# Altium schematic sheet distance measurement.SchDoc
size A4
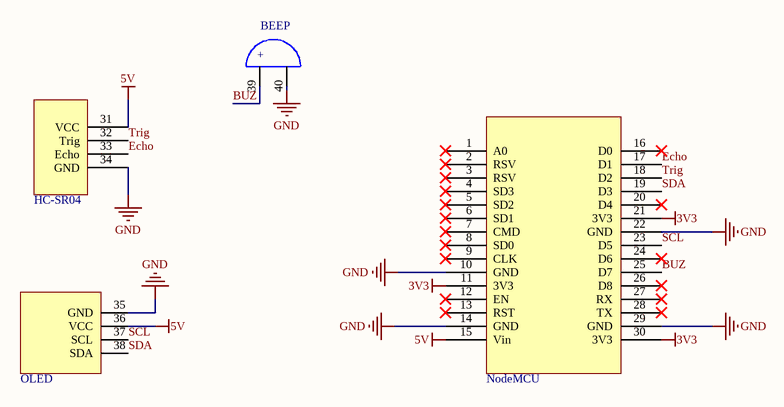
[diagram p0: distance measurement.SchDoc]

## Parts
B  BEEP  [BUZ-TH_BD9.0-P5.00-D0.6-FD]
H  HC-SR04  [HC-SR04]
O  OLED  [0.96OLEDIIC]
U  NodeMCU  [PCBComponent_1 - duplicate]

## Nets
3V3: U.11(3V3) U.21(3V3) U.30(3V3)
5V: H.31(VCC) O.36(VCC) U.15(Vin)
GND: B.40(nega) H.34(GND) O.35(GND) U.10(GND) U.14(GND) U.22(GND) U.29(GND)
BUZ: B.39(posi) U.25(D7)
Echo: H.33(Echo) U.17(D1)
SCL: O.37(SCL) U.23(D5)
SDA: O.38(SDA) U.19(D3)
Trig: H.32(Trig) U.18(D2)

Not connected (* = marked no-connect by the designer): U 1(A0)* 2(RSV)* 3(RSV)* 4(SD3)* 5(SD2)* 6(SD1)* 7(CMD)* 8(SD0)* 9(CLK)* 12(EN)* 13(RST)* 16(D0)* 20(D4)* 24(D6)* 26(D8)* 27(RX)* 28(TX)*

## Notes on the sheet
- (in symbol BEEP) +